# EAGLE schematic OLM-periph-probe+ambientREVA (EAGLE 6.4)
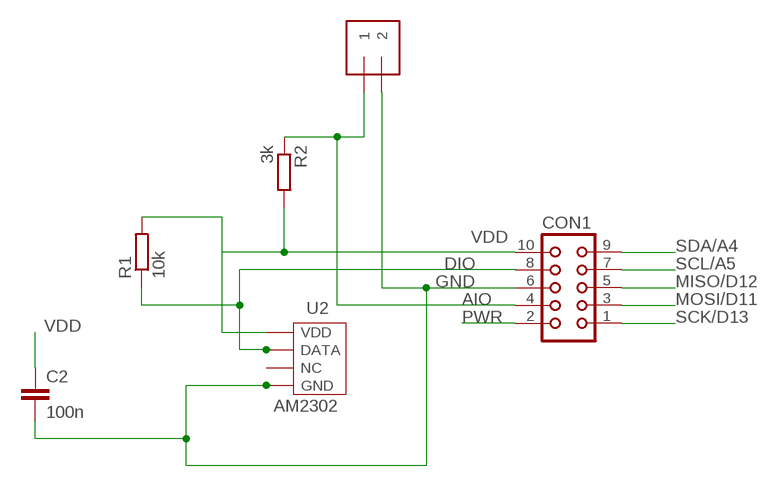
[diagram p0: schematic, sheet 1]

## Parts
C2  100n  C-EU025-024X044  [C025-024X044]
CON1  CON10L  [CON10L]
J1  1X2-3.5MM  [1X2-3.5MM]
R1  10k  R-EU_0204/7  [0204/7]
R2  3k  R-EU_0204/7  [0204/7]
U2  AM2302  [AM2302]

## Nets
AIO: CON1.4 J1.1 R2.1
DIO: CON1.8 R1.1 U2.P$2(DATA)
GND: C2.2 CON1.6 J1.2 U2.P$4(GND)
MISO/D12: CON1.5
MOSI/D11: CON1.3
PWR: CON1.2
SCK/D13: CON1.1
SCL/A5: CON1.7
SDA/A4: CON1.9
VDD: C2.1 CON1.10 R1.2 R2.2 U2.P$1(VDD)
Unconnected: U2.P$3(NC)

## Library data of the parts
C2 = resistor:C-EU: CAPACITOR, European symbol
CON1 = con-harting:CON10L: CONNECTOR; OC_FARNELL: unknown; OC_NEWARK: unknown
J1 = adafruit:1X2: 3.5mm Terminal block http://www.ladyada.net/library/pcb/eaglelibrary.html
R1 R2 = resistor:R-EU_: RESISTOR, European symbol
U2 = sensor:AM2302

## Net classes
1 power: width 0.813 mm, drill 0.254 mm, clearance 0.254 mm